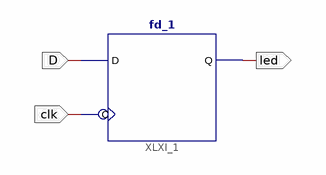
[diagram p0: schematic sheet 1]
// Xilinx ISE schematic dffTest.sch (spartan3e) as structural Verilog: 1 symbols, 3 ports
module dffTest (
  input  D,
  input  clk,
  output led
);

  fd_1 XLXI_1 (.C(clk), .D(D), .Q(led));
endmodule
